# EAGLE design Lightbox schematic_29OCT (EAGLE 9.2.2)
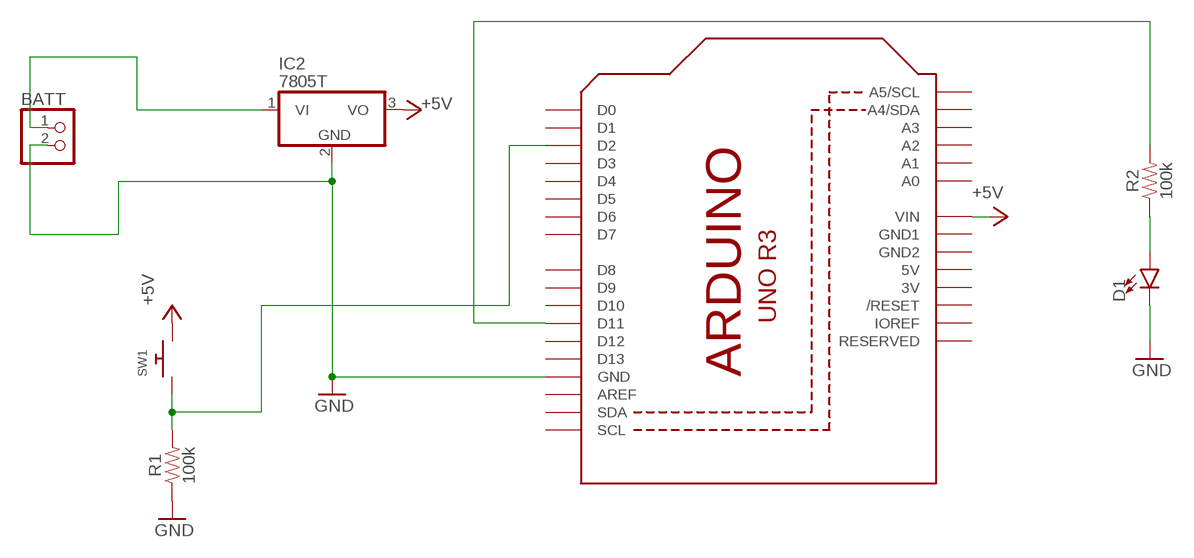
[diagram p0: schematic, sheet 1]

## Parts
BATT  PINHD-1X2  [1X02]
D1  LED3MM  [LED_3MM]
IC2  7805T  [TO220H]
R1  100k  100KOHM-HORIZ-1/4W-1%  [AXIAL-0.3]
R2  100k  100KOHM-HORIZ-1/4W-1%  [AXIAL-0.3]
SW1  SWITCH_PUSHBUTTONSOFTTOUCHSMD_SJ  [PUSHBUTTON_SMD_SJ]
U1  ARDUINOR3-DIMENSION  [ARDUINOR3]

## Nets
+5V: IC2.3(VO) SW1.P$2 U1.VIN
BATT: BATT.1 IC2.1(VI)
GND: BATT.2 D1.K(C) IC2.2(GND) R1.P$1 U1.GND
N$2: R1.P$2 SW1.P$1 U1.D2
N$3: R2.P$2 U1.D11
N$4: D1.A R2.P$1
Unconnected: U1.A0 U1.A1 U1.A2 U1.A3 U1.A4(A4/SDA) U1.A5(A5/SCL) U1.AREF U1.D0 U1.D1 U1.D3 U1.D4 U1.D5 U1.D6 U1.D7 U1.D8 U1.D9 U1.D10 U1.D12 U1.D13 U1.IOREF U1.RESERVED U1.RESET(/RESET) U1.SCL U1.SDA

## Power pins joined to a net without a drawn wire
3V: U1.3V
5V: U1.5V
GND1: U1.GND1
GND2: U1.GND2

## Library data of the parts
BATT = pinhead:PINHD-1X2: PIN HEADER
D1 = SparkFun-LED:LED: LED (Generic) Standard schematic elements and footprints for 5mm, 3mm, 1206, and 0603 sized LEDs. Generic LEDs with no color specified.; PROD_ID: DIO-08794
IC2 = linear:78*: Positive VOLTAGE REGULATOR Source: http://cache.national.com/ds/LM/LM78L05.pdf http://www.fairchildsemi.com/ds/LM/LM7805.pdf
R1 R2 = SparkFun-Resistors:100KOHM: 100kΩ resistor A resistor is a passive two-terminal electrical component that implements electrical resistance as a circuit element. Resistors act to reduce current flow, and, at the same time, act to lower voltage levels within circuits. - Wikipedia; PROD_ID: RES-12184
SW1 = adafruit:SWITCH_PUSHBUTTON: Buttons SOFTTOUCHSMD_SJ - Soft touch temporary push button (Super Junk Akihabara) Compatible with SKPMANE010 [Mouser: 688-SKPMAN] C&K_KSS = Digikey: KSS221GLFS
U1 = adafruit:ARDUINOR3: This is a new object for the new Arduino R3 - with extra pins that you may want to use (such as IOref, and duplicated A4/A5

## Net classes
0 default: width 0.508 mm

## Board
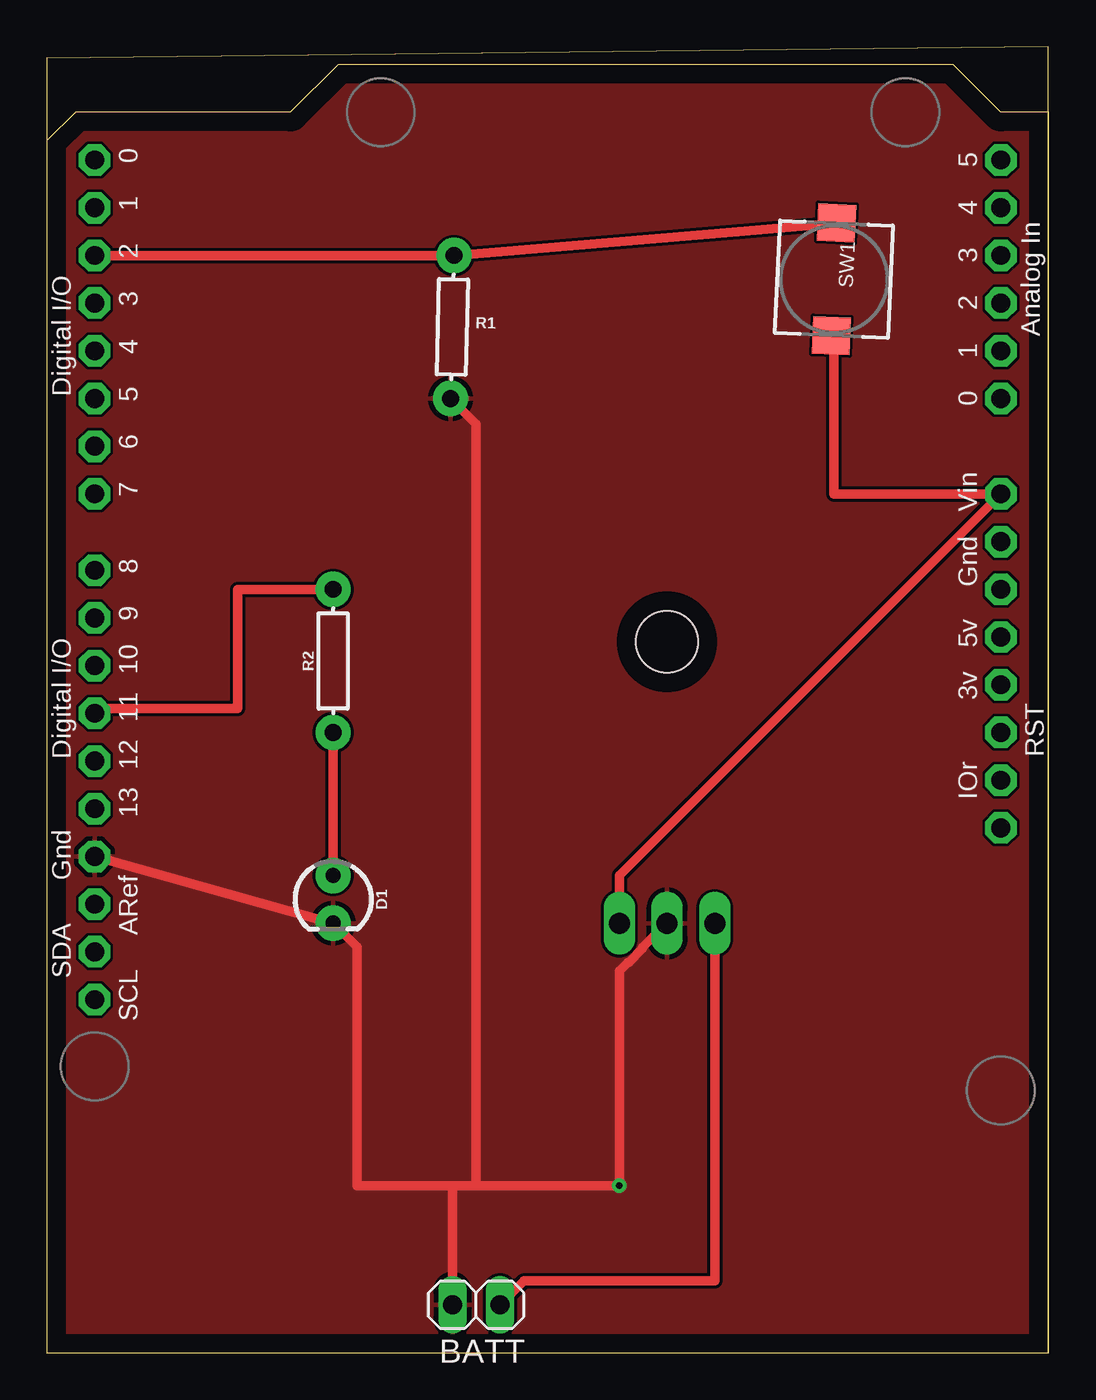
[diagram p1: board, top side]
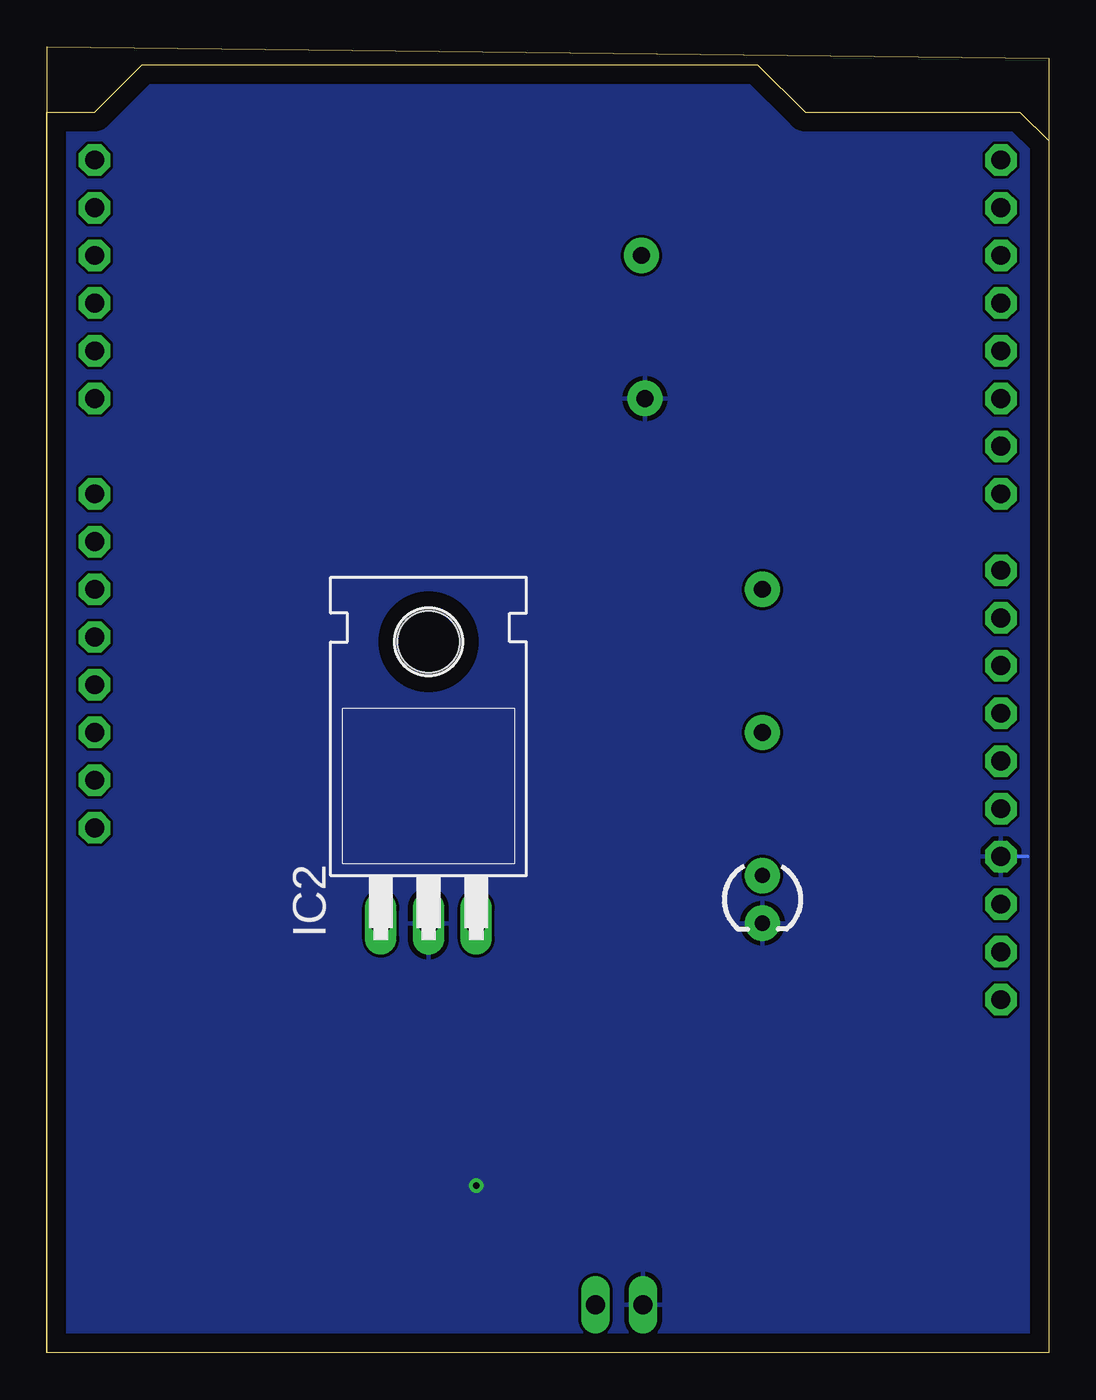
[diagram p2: board, bottom side, seen from below]

Size 53.34 x 69.52 mm. Coordinates in mm from the lower left corner, seen from the top.
Outline: 0,0 53.32,0 53.32,69.52 0,68.91 0,0
Copper layers (1*16): Top 0.035mm / dielectric 1.5mm / Bottom 0.035mm
Design rules "default": minimum track width 6mil, minimum drill 0.35mm, track to track 6mil, track to pad 6mil, pad to pad 6mil, via to via 6mil, smd to smd 6mil, copper to edge 40mil, drill to drill 6mil, minimum pad ring 10mil, minimum via ring 8mil, stop-mask expansion 4mil, vias tented up to drill 0mil, thermal gap 10mil

### Footprints (pad centres in the part's own frame; a part is rotated, then mirrored left to right if it is on the bottom)
1X02 = drill 1.016 long: 1 -1.27,0; 2 1.27,0
LED_3MM = drill 0.813 pad 1.88: A -1.27,0; K 1.27,0
TO220H = drill 1.118 long: 1 -2.54,-10.16; 2 0,-10.16; 3 2.54,-10.16 | hole 3.302: 0,4.826
AXIAL-0.3 = drill 0.9 pad 1.88: P$1 -3.81,0; P$2 3.81,0
PUSHBUTTON_SMD_SJ = smd 2 x 2: P$1 3,0; P$2 -3,0
ARDUINOR3 = drill 1 pad 1.676 octagon: 3V 35.56,2.54; 5V 38.1,2.54; A0 50.8,2.54; A1 53.34,2.54; A2 55.88,2.54; A3 58.42,2.54; A4 60.96,2.54; A5 63.5,2.54; AREF 23.876,50.8; D0 63.5,50.8; D1 60.96,50.8; D2 58.42,50.8; D3 55.88,50.8; D4 53.34,50.8; D5 50.8,50.8; D6 48.26,50.8; D7 45.72,50.8; D8 41.656,50.8; D9 39.116,50.8; D10 36.576,50.8; D11 34.036,50.8; D12 31.496,50.8; D13 28.956,50.8; GND 26.416,50.8; GND1 43.18,2.54; GND2 40.64,2.54; IOREF 30.48,2.54; RESERVED 27.94,2.54; RESET 33.02,2.54; SCL 18.796,50.8; SDA 21.336,50.8; VIN 45.72,2.54

### Placement (x,y rotation side)
BATT  22.86,2.54 180 top
D1  15.24,24.13 270 top
IC2  33.02,33.02 0 bottom
R1  21.59,54.61 88.6 top
R2  15.24,36.83 90 top
SW1  41.91,57.15 87.4 top
U1  53.34,0 90 top

### Tracks (layer width: path | path; a pad name or v marks a point on that pad's centre or on a via)
+5V
  Top 0.508: IC2.3 30.48,25.4 U1.VIN 41.91,45.72 41.91,54.02 SW1.P$2
BATT
  Top 0.508: BATT.1 25.4,3.81 35.56,3.81 IC2.1
GND  (via drill 0.35)
  Top 0.508: U1.GND D1.K 16.51,21.59 16.51,8.89 21.59,8.89 | 21.59,8.89 22.86,8.89 | 22.86,8.89 v30.48,8.89 30.48,20.32 30.94,20.78 31,20.78 31.73,21.51 31.73,21.56 IC2.2 | R1.P$1 22.86,49.44 22.86,8.89 | BATT.2 21.59,8.89
  Bottom 0.152: 1.09,26.42 U1.GND
  pour Bottom: -45.72,91.44 -45.72,-3.81 -44.45,-5.08 57.15,-5.08 57.15,91.44 54.61,93.98 -43.18,93.98
  pour Top: -45.72,92.71 -45.72,-2.54 -43.18,-5.08 54.61,-5.08 55.88,-3.81 55.88,92.71
N$2
  Top 0.508: U1.D2 R1.P$2 36.83,59.69 SW1.P$1
N$3
  Top 0.508: U1.D11 2.79,34.29 10.16,34.29 10.16,40.64 R2.P$2
N$4
  Top 0.508: R2.P$1 D1.A